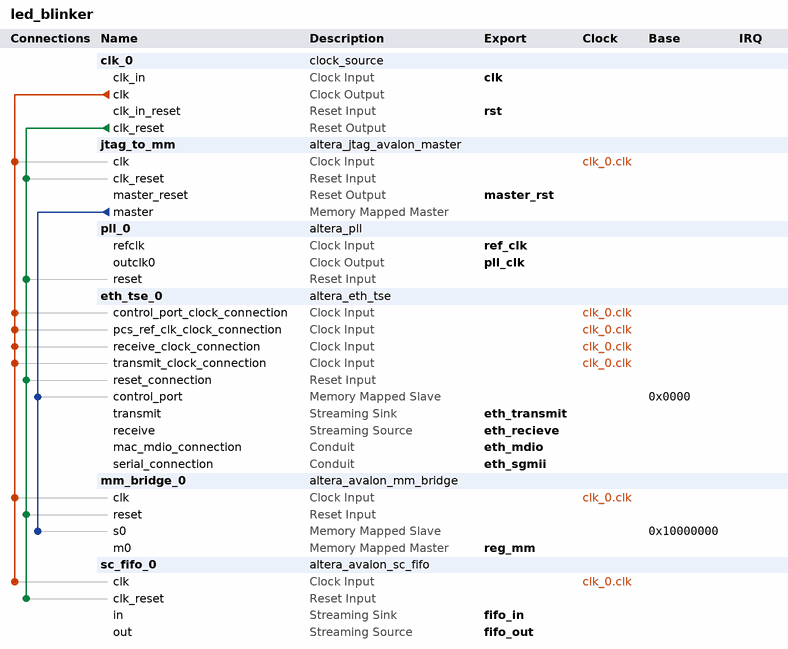
[diagram p0: system contents]
# Platform Designer (Qsys) system led_blinker, Cyclone V 5CSXFC6D6F31I7
# Parameters at their usual value, and those the tool derives, are not listed.
package require -exact qsys 19.1
create_system led_blinker
set_project_property DEVICE_FAMILY {Cyclone V}
set_project_property DEVICE 5CSXFC6D6F31I7

add_instance clk_0 clock_source 19.1
set_instance_parameter_value clk_0 clockFrequency 125000000

add_instance jtag_to_mm altera_jtag_avalon_master 19.1

add_instance pll_0 altera_pll 19.1
set_instance_parameter_value pll_0 gui_device_speed_grade 1
set_instance_parameter_value pll_0 gui_number_of_clocks 1
set_instance_parameter_value pll_0 gui_operation_mode direct
set_instance_parameter_value pll_0 gui_output_clock_frequency0 125.0
set_instance_parameter_value pll_0 gui_pll_mode {Integer-N PLL}
set_instance_parameter_value pll_0 gui_ps_units0 degrees
set_instance_parameter_value pll_0 gui_reference_clock_frequency 125.0
set_instance_parameter_value pll_0 gui_use_locked false

add_instance eth_tse_0 altera_eth_tse 19.1
set_instance_parameter_value eth_tse_0 XCVR_RCFG_JTAG_ENABLE 0
set_instance_parameter_value eth_tse_0 XCVR_SET_CAPABILITY_REG_ENABLE 0
set_instance_parameter_value eth_tse_0 XCVR_SET_CSR_SOFT_LOGIC_ENABLE 0
set_instance_parameter_value eth_tse_0 XCVR_SET_PRBS_SOFT_LOGIC_ENABLE 0
set_instance_parameter_value eth_tse_0 XCVR_SET_USER_IDENTIFIER 0
set_instance_parameter_value eth_tse_0 core_variation MAC_PCS
set_instance_parameter_value eth_tse_0 enable_hd_logic false
set_instance_parameter_value eth_tse_0 enable_mac_flow_ctrl false
set_instance_parameter_value eth_tse_0 enable_magic_detect false
set_instance_parameter_value eth_tse_0 enable_sgmii true
set_instance_parameter_value eth_tse_0 enable_shift16 true
set_instance_parameter_value eth_tse_0 ifGMII MII_GMII
set_instance_parameter_value eth_tse_0 ing_addr 11
set_instance_parameter_value eth_tse_0 mdio_clk_div 125
set_instance_parameter_value eth_tse_0 stat_cnt_ena true
set_instance_parameter_value eth_tse_0 transceiver_type GXB

add_instance mm_bridge_0 altera_avalon_mm_bridge 19.1
set_instance_parameter_value mm_bridge_0 ADDRESS_UNITS SYMBOLS
set_instance_parameter_value mm_bridge_0 ADDRESS_WIDTH 10
set_instance_parameter_value mm_bridge_0 DATA_WIDTH 32
set_instance_parameter_value mm_bridge_0 MAX_PENDING_RESPONSES 4
set_instance_parameter_value mm_bridge_0 PIPELINE_COMMAND 0
set_instance_parameter_value mm_bridge_0 PIPELINE_RESPONSE 0
set_instance_parameter_value mm_bridge_0 USE_AUTO_ADDRESS_WIDTH 1

add_instance sc_fifo_0 altera_avalon_sc_fifo 19.1
set_instance_parameter_value sc_fifo_0 BITS_PER_SYMBOL 8
set_instance_parameter_value sc_fifo_0 CHANNEL_WIDTH 0
set_instance_parameter_value sc_fifo_0 ERROR_WIDTH 0
set_instance_parameter_value sc_fifo_0 FIFO_DEPTH 16
set_instance_parameter_value sc_fifo_0 SYMBOLS_PER_BEAT 4
set_instance_parameter_value sc_fifo_0 USE_FILL_LEVEL 0
set_instance_parameter_value sc_fifo_0 USE_MEMORY_BLOCKS 1
set_instance_parameter_value sc_fifo_0 USE_PACKETS 1
set_instance_parameter_value sc_fifo_0 USE_STORE_FORWARD 0

# connections
add_connection clk_0.clk eth_tse_0.control_port_clock_connection clock
add_connection clk_0.clk eth_tse_0.pcs_ref_clk_clock_connection clock
add_connection clk_0.clk eth_tse_0.receive_clock_connection clock
add_connection clk_0.clk eth_tse_0.transmit_clock_connection clock
add_connection clk_0.clk jtag_to_mm.clk clock
add_connection clk_0.clk mm_bridge_0.clk clock
add_connection clk_0.clk sc_fifo_0.clk clock
add_connection clk_0.clk_reset eth_tse_0.reset_connection reset
add_connection clk_0.clk_reset jtag_to_mm.clk_reset reset
add_connection clk_0.clk_reset mm_bridge_0.reset reset
add_connection clk_0.clk_reset pll_0.reset reset
add_connection clk_0.clk_reset sc_fifo_0.clk_reset reset
add_connection jtag_to_mm.master eth_tse_0.control_port avalon
set_connection_parameter_value jtag_to_mm.master/eth_tse_0.control_port baseAddress 0x0000
add_connection jtag_to_mm.master mm_bridge_0.s0 avalon
set_connection_parameter_value jtag_to_mm.master/mm_bridge_0.s0 baseAddress 0x10000000

# exported interfaces
add_interface clk clock sink
set_interface_property clk EXPORT_OF clk_0.clk_in
add_interface eth_mdio conduit end
set_interface_property eth_mdio EXPORT_OF eth_tse_0.mac_mdio_connection
add_interface eth_recieve avalon_streaming source
set_interface_property eth_recieve EXPORT_OF eth_tse_0.receive
add_interface eth_sgmii conduit end
set_interface_property eth_sgmii EXPORT_OF eth_tse_0.serial_connection
add_interface eth_transmit avalon_streaming sink
set_interface_property eth_transmit EXPORT_OF eth_tse_0.transmit
add_interface fifo_in avalon_streaming sink
set_interface_property fifo_in EXPORT_OF sc_fifo_0.in
add_interface fifo_out avalon_streaming source
set_interface_property fifo_out EXPORT_OF sc_fifo_0.out
add_interface master_rst reset source
set_interface_property master_rst EXPORT_OF jtag_to_mm.master_reset
add_interface pll_clk clock source
set_interface_property pll_clk EXPORT_OF pll_0.outclk0
add_interface ref_clk clock sink
set_interface_property ref_clk EXPORT_OF pll_0.refclk
add_interface reg_mm avalon master
set_interface_property reg_mm EXPORT_OF mm_bridge_0.m0
add_interface rst reset sink
set_interface_property rst EXPORT_OF clk_0.clk_in_reset

set_interconnect_requirement {$system} qsys_mm.clockCrossingAdapter HANDSHAKE
set_interconnect_requirement {$system} qsys_mm.enableEccProtection FALSE
set_interconnect_requirement {$system} qsys_mm.insertDefaultSlave FALSE
set_interconnect_requirement {$system} qsys_mm.maxAdditionalLatency 1

save_system led_blinker.qsys
